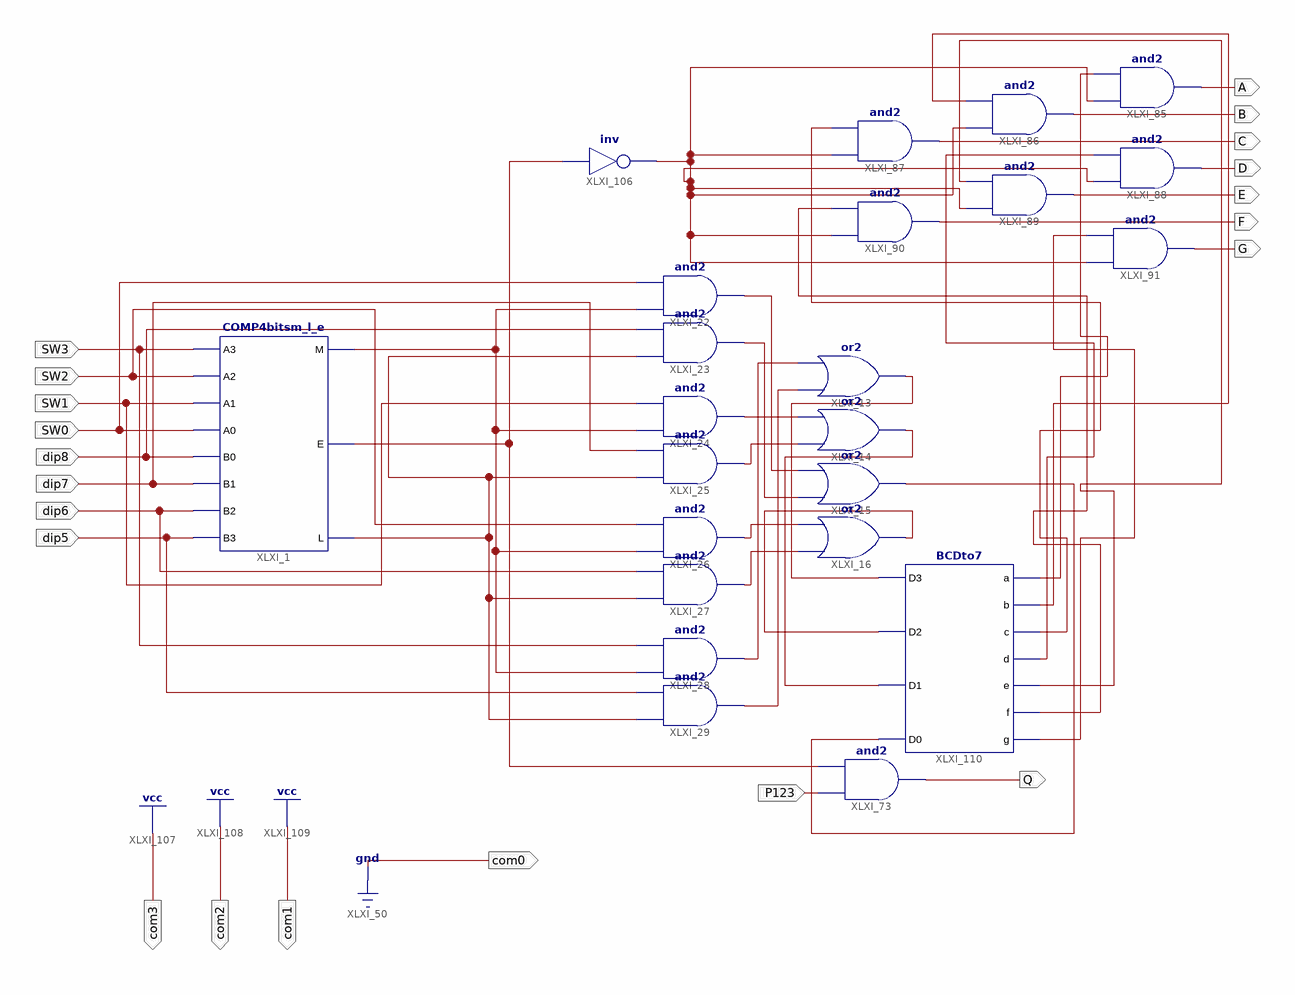
[diagram p0: schematic sheet 1]
// Xilinx ISE schematic MOLOE.sch (spartan6) as structural Verilog: 23 symbols, 21 ports
module MOLOE (
  input  SW0,
  input  SW1,
  input  SW2,
  input  SW3,
  input  dip8,
  input  dip7,
  input  dip6,
  input  dip5,
  input  P123,
  output com2,
  output com3,
  output Q,
  output C,
  output D,
  output E,
  output F,
  output G,
  output B,
  output A,
  output com0,
  output com1
);

  wire comq, XLXN_4, XLXN_5, XLXN_6, XLXN_16, XLXN_20, XLXN_34, XLXN_35, XLXN_36, XLXN_37, XLXN_38, XLXN_39,
       XLXN_40, XLXN_41, XLXN_147, XLXN_149, XLXN_150, XLXN_165, XLXN_166, XLXN_167, XLXN_168, XLXN_169,
       XLXN_170;

  COMP4bitsm_l_e XLXI_1 (
    .A3(SW3), .A2(SW2), .A1(SW1), .A0(SW0), .B0(dip8), .B1(dip7), .B2(dip6), .B3(dip5), .M(XLXN_16),
    .E(comq), .L(XLXN_20));
  and XLXI_24 (XLXN_36, XLXN_16, SW1);
  and XLXI_25 (XLXN_37, XLXN_20, dip7);
  and XLXI_23 (XLXN_35, XLXN_20, dip8);
  and XLXI_22 (XLXN_34, XLXN_16, SW0);
  and XLXI_26 (XLXN_38, XLXN_16, SW2);
  and XLXI_27 (XLXN_39, XLXN_20, dip6);
  and XLXI_28 (XLXN_40, XLXN_16, SW3);
  and XLXI_29 (XLXN_41, XLXN_20, dip5);
  and XLXI_73 (Q, P123, comq);
  and XLXI_87 (C, XLXN_149, XLXN_167);
  and XLXI_88 (D, XLXN_149, XLXN_168);
  and XLXI_89 (E, XLXN_149, XLXN_169);
  and XLXI_90 (F, XLXN_149, XLXN_170);
  and XLXI_91 (G, XLXN_149, XLXN_147);
  and XLXI_86 (B, XLXN_149, XLXN_166);
  and XLXI_85 (A, XLXN_149, XLXN_165);
  or XLXI_13 (XLXN_4, XLXN_41, XLXN_40);
  or XLXI_14 (XLXN_5, XLXN_37, XLXN_36);
  or XLXI_15 (XLXN_6, XLXN_35, XLXN_34);
  or XLXI_16 (XLXN_150, XLXN_39, XLXN_38);
  not XLXI_106 (XLXN_149, comq);
  BCDto7 XLXI_110 (
    .D3(XLXN_4), .D2(XLXN_150), .D1(XLXN_5), .D0(XLXN_6), .a(XLXN_165), .b(XLXN_166), .c(XLXN_167),
    .d(XLXN_168), .e(XLXN_169), .f(XLXN_170), .g(XLXN_147));

  assign com0 = 1'b0;
  assign com1 = 1'b1;
  assign com2 = 1'b1;
  assign com3 = 1'b1;
endmodule
